# EAGLE design Diag_586220_Cassette (EAGLE 9.2.2)
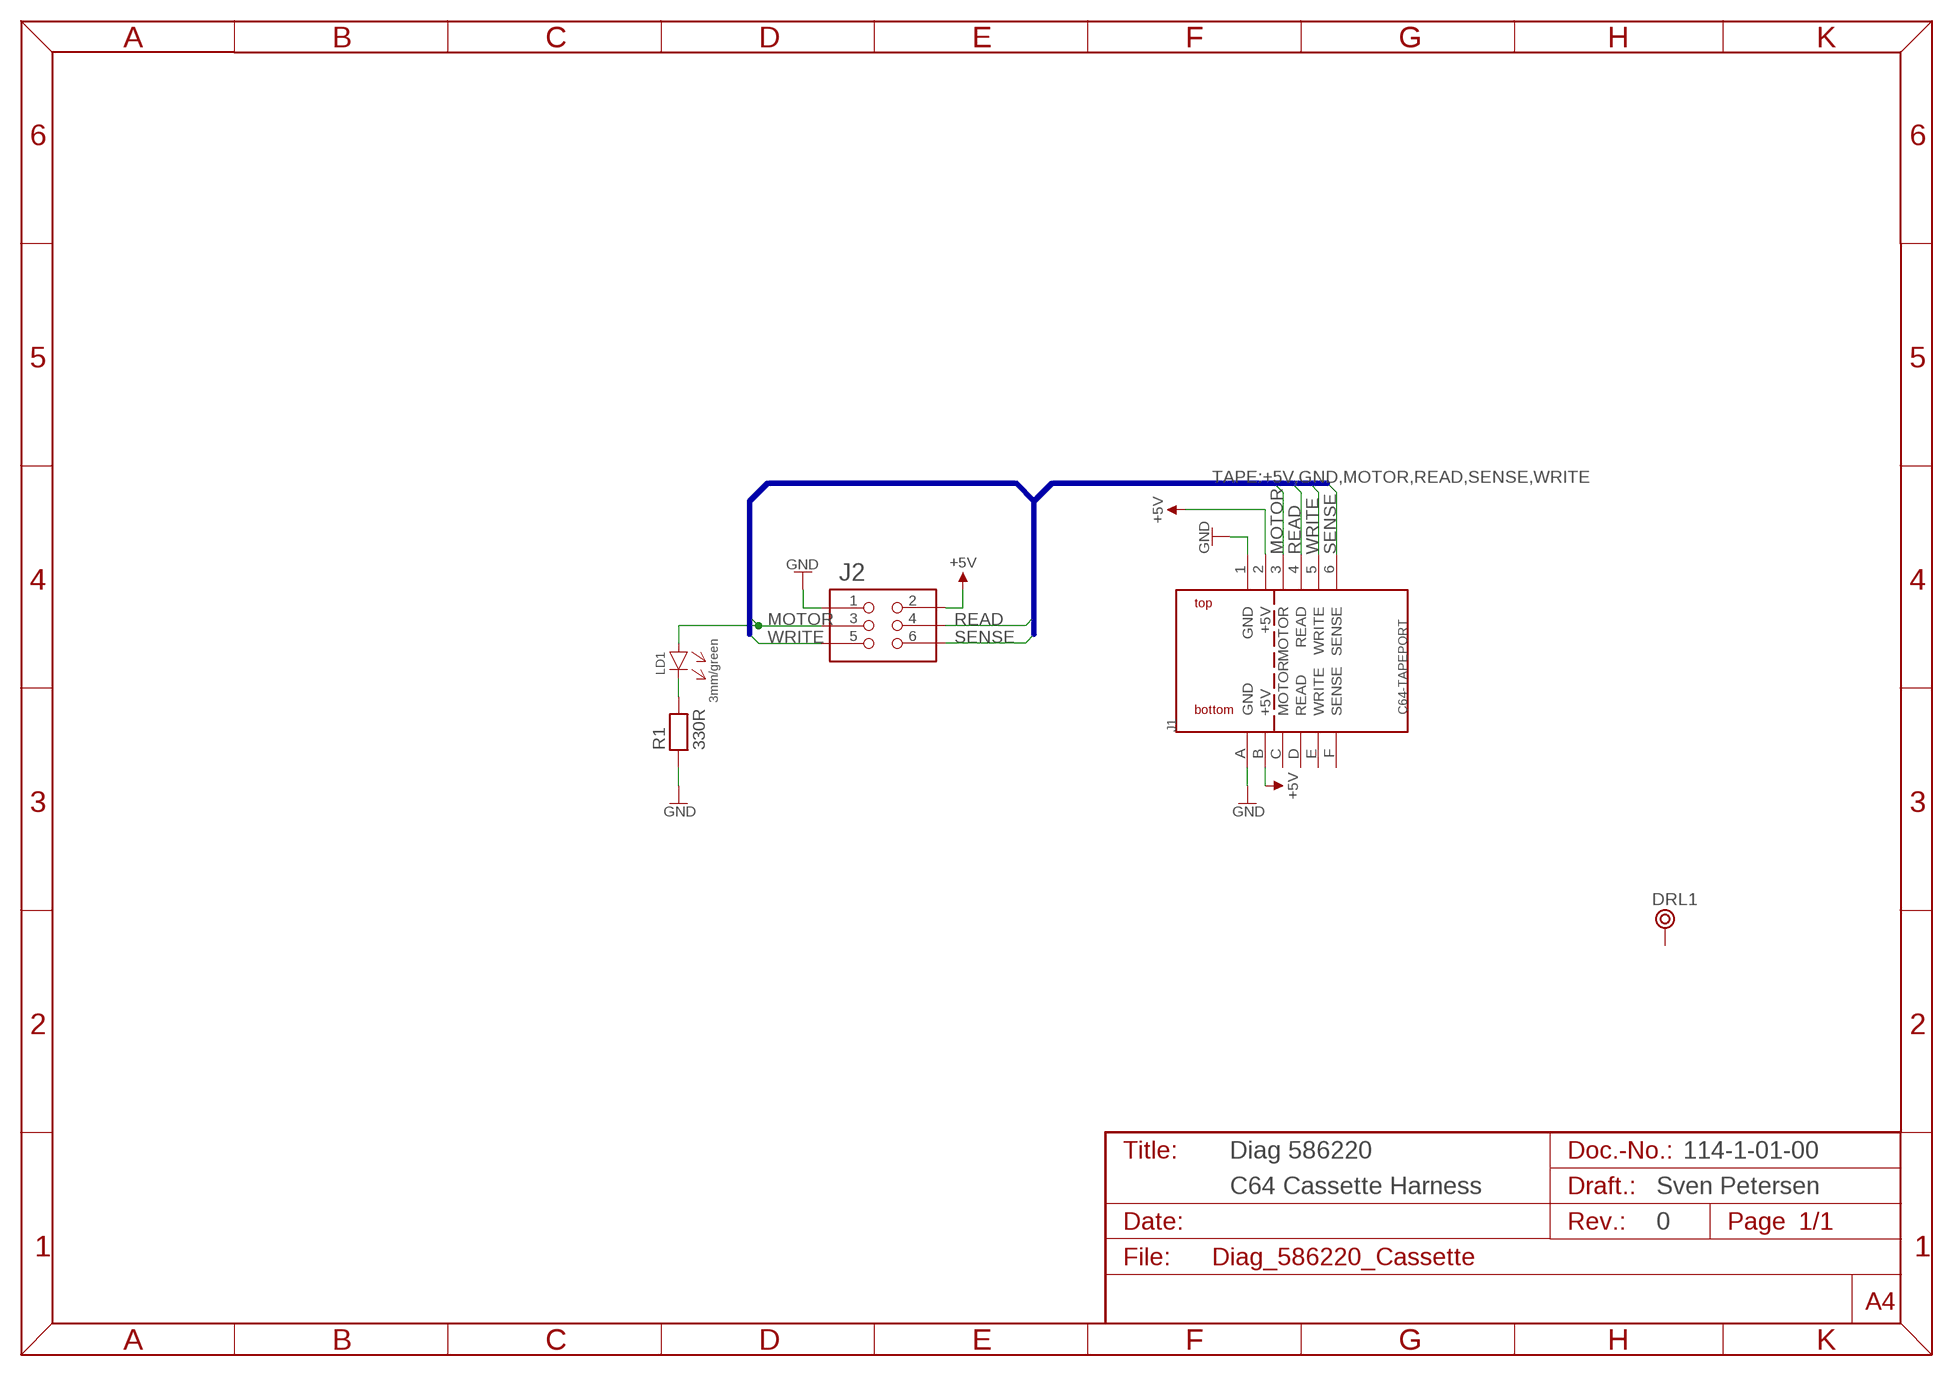
[diagram p0: schematic, sheet 1]

## Parts
DRL1  BOHR3,5  [BOHR3,5]
J1  C64-TAPEPORT  [TAPEPORT]
J2  2X03WV  [2X03WV]
LD1  3mm/green  3MM  [3MM]
R1  330R  RES01  [RS-2,5]

## Nets
+5V: J1.2(+5V) J1.B(+5V) J2.2
GND: J1.1(GND) J1.A(GND) J2.1 R1.1
MOTOR: J1.3(MOTOR) J2.3 LD1.A
N$1: LD1.C(K) R1.2
READ: J1.4(READ) J2.4
SENSE: J1.6(SENSE) J2.6
WRITE: J1.5(WRITE) J2.5
Unconnected: DRL1.P$1 J1.C(MOTOR) J1.D(READ) J1.E(WRITE) J1.F(SENSE)

## Buses
TAPE:+5V,GND,MOTOR,READ,SENSE,WRITE

## Notes on the sheet
- Diag 586220 | 114-1-01-00
- C64 Cassette Harness | Sven Petersen
- 0

## Library data of the parts
DRL1 = Mech_Bohr:BOHR3,5
J1 = Commodore:C64-TAPEPORT
J2 = PINHEAD:2X03WV
LD1 = LED:3MM
R1 = DISCRETE:RES01

## Board
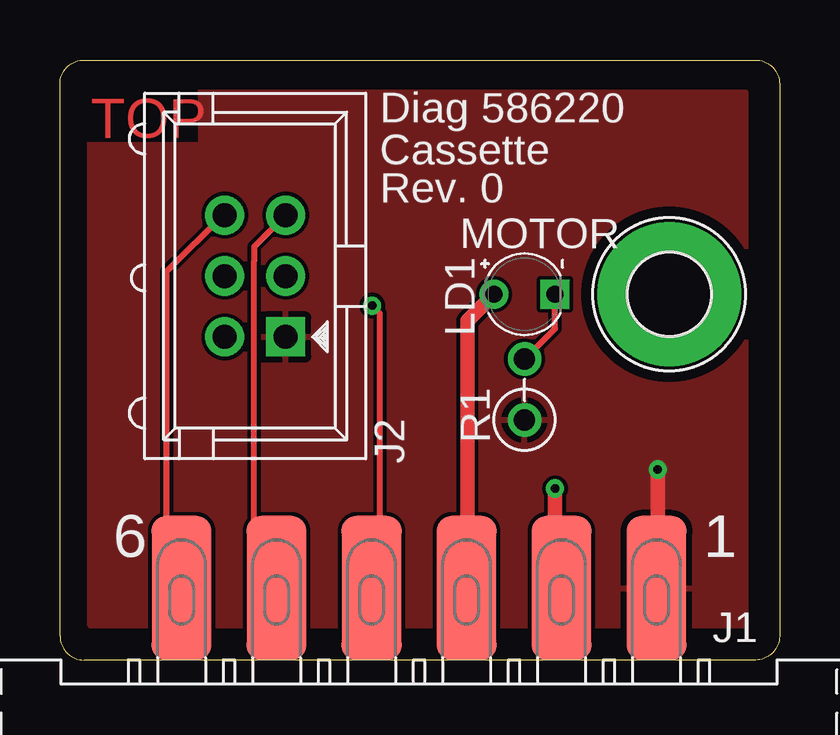
[diagram p1: board, top side]
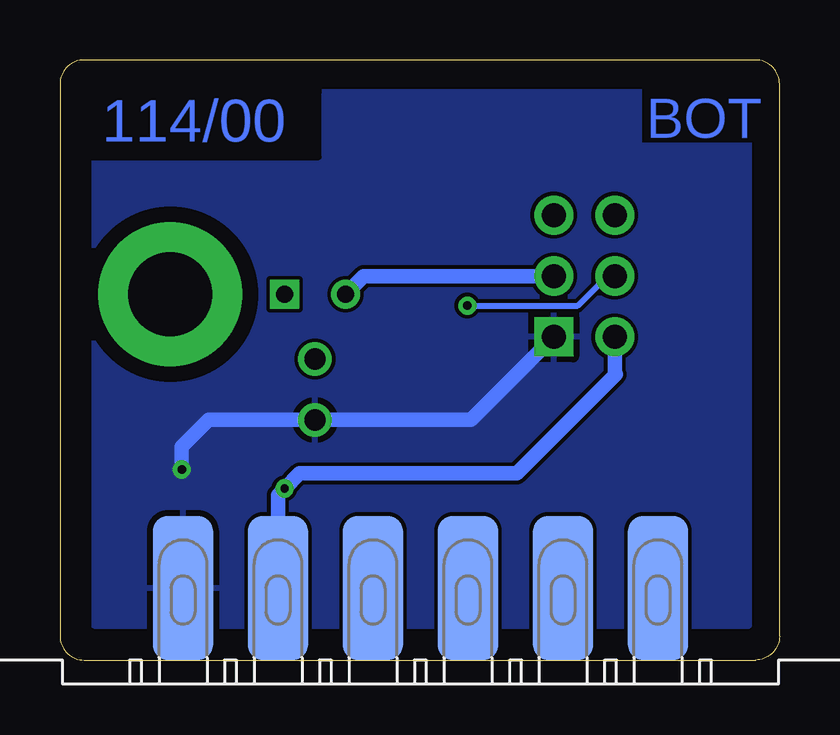
[diagram p2: board, bottom side, seen from below]

Size 30 x 25 mm. Coordinates in mm from the lower left corner, seen from the top.
Outline: 0,1 0,24 arc-90 1,25 29,25 arc-90 30,24 30,1 arc-90 29,0 1,0 arc-90 0,1
Copper layers (1*16): Top 0.035mm / dielectric 1.5mm / Bottom 0.035mm
Design rules "default *": minimum track width 6mil, minimum drill 0.35mm, track to track 6mil, track to pad 6mil, pad to pad 6mil, via to via 6mil, smd to smd 6mil, copper to edge 40mil, drill to drill 6mil, minimum pad ring 10mil, minimum via ring 8mil, stop-mask expansion 4mil, vias tented up to drill 24mil, thermal gap 10mil
bRestrict: 2 lines

### Footprints (pad centres in the part's own frame; a part is rotated, then mirrored left to right if it is on the bottom)
BOHR3,5 = drill 3.5 pad 6: P$1 0,0
TAPEPORT = smd 2.5 x 6: 1 -9.9,-3; 2 -5.94,-3; 3 -1.98,-3; 4 1.98,-3; 5 5.94,-3; 6 9.9,-3 | smd 2.5 x 6 bottom: A -9.9,-3; B -5.94,-3; C -1.98,-3; D 1.98,-3; E 5.94,-3; F 9.9,-3
2X03WV = drill 1 pad 1.626 square: 1 -2.54,-1.27 | drill 1 pad 1.626: 2 -2.54,1.27; 3 0,-1.27; 4 0,1.27; 5 2.54,-1.27; 6 2.54,1.27
3MM = drill 0.7: A -1.27,0 | drill 0.7 square: C 1.27,0
RS-2,5 = drill 0.889 pad 1.397: 1 0,0; 2 2.54,0

### Placement (x,y rotation side)
DRL1  25.4,15.24 0 top
J1  14.97,0 180 top
J2  8.14,16 90 top
LD1  19.37,15.24 0 top
R1  19.37,10 90 top
U$5  [PCB-TITLE/]  0,33 0 top  (outside the outline)
U$6  [2LAYER]  1.27,21.75 0 top

### Tracks (layer width: path | path; a pad name or v marks a point on that pad's centre or on a via)
+5V  (via drill 0.35)
  Top 0.61: v20.64,7.14 20.64,3.27 J1.B
  Bottom 0.61: J1.B 20.91,6.87 v20.64,7.14 20,7.78 10.95,7.78 6.83,11.91 6.87,11.95 J2.2
GND  (via drill 0.35)
  Top 0.61: v24.92,7.94 24.92,3.05 J1.1
  Bottom 0.61: v24.92,7.94 24.92,8.89 23.81,10 R1.1 12.87,10 J2.1
  pour Top: 1.27,23.65 28.57,23.65 28.57,1.43 1.27,1.43
  pour Bottom: 1.27,23.65 28.57,23.65 28.57,1.43 1.27,1.43
MOTOR
  Top 0.254: J1.3 16.99,3.04
  Top 0.61: 16.99,3.04 16.99,14.13 LD1.A
  Bottom 0.61: LD1.A 17.34,16 J2.3
N$1
  Top 0.254: R1.2 20.64,13.81 LD1.C
READ  (via drill 0.35)
  Top 0.254: v13.02,14.76 13.34,14.45 13.34,3.17 13.16,3 J1.4
  Bottom 0.254: v13.02,14.76 8.41,14.76 7.18,16 J2.4
SENSE
  Top 0.254: J1.6 4.45,3.62 4.45,16.19 6.79,18.54 J2.6
WRITE
  Top 0.254: J1.5 8.1,3.93 8.1,16.64 8.1,17.23 J2.5

### Text on the board
Bottom: 114/00
tPlace: Diag 586220 | Cassette | Rev. 0 | MOTOR | 6 | 1
Document: 114-2-01-00 | Diag 586220 / Harness | 35µm | 2 | 0